# EAGLE design statuspanel (EAGLE 9.6.2)
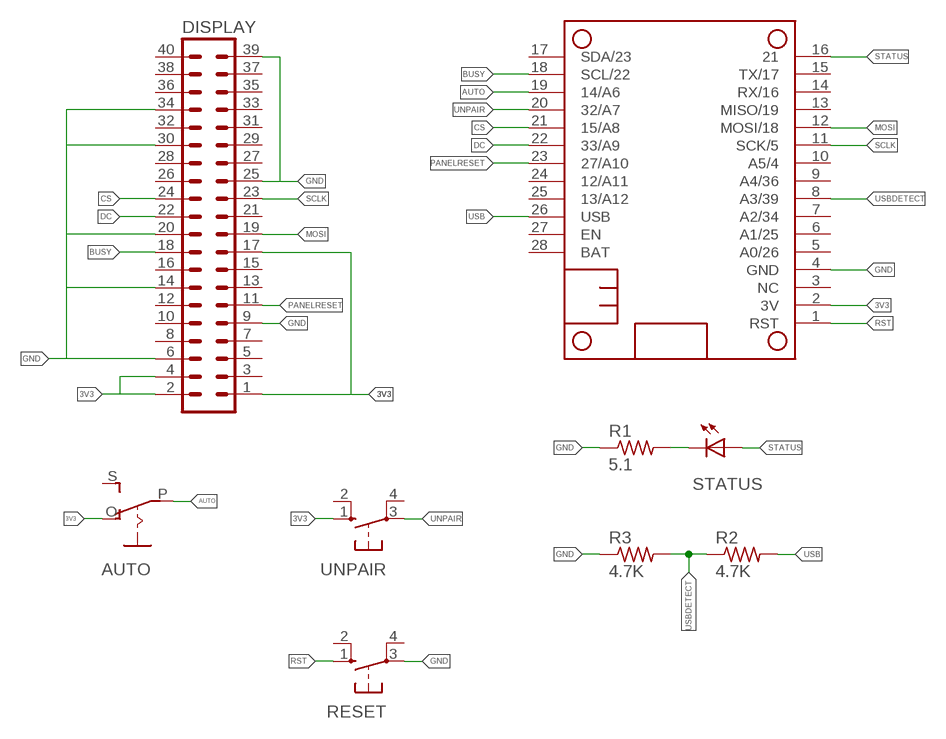
[diagram p0: schematic, sheet 1]

## Parts
AUTO  EG1218S  [EG1218]
DISPLAY  MA20-2  [MA20-2]
HUZZAH32  HUZZAH32_NODIM  [FEATHERWING_DIM]
R1  5.1  R-US_R0805  [R0805]
R2  4.7K  R-US_R0805  [R0805]
R3  4.7K  R-US_R0805  [R0805]
RESET  10-XX  [B3F-10XX]
STATUS  LED3MM  [LED3MM]
UNPAIR  10-XX  [B3F-10XX]

## Nets
3V3: AUTO.O DISPLAY.1 DISPLAY.2 DISPLAY.4 DISPLAY.17 HUZZAH32.2(3V) UNPAIR.1(S)
AUTO: AUTO.P HUZZAH32.19(14/A6)
BUSY: DISPLAY.18 HUZZAH32.18(SCL/22)
CS: DISPLAY.24 HUZZAH32.21(15/A8)
DC: DISPLAY.22 HUZZAH32.22(33/A9)
GND: DISPLAY.6 DISPLAY.9 DISPLAY.14 DISPLAY.20 DISPLAY.25 DISPLAY.30 DISPLAY.34 DISPLAY.39 HUZZAH32.4(GND) R1.1 R3.1 RESET.3(P)
MOSI: DISPLAY.19 HUZZAH32.12(MOSI/18)
N$3: R1.2 STATUS.K(C)
PANELRESET: DISPLAY.11 HUZZAH32.23(27/A10)
RST: HUZZAH32.1(RST) RESET.1(S)
SCLK: DISPLAY.23 HUZZAH32.11(SCK/5)
STATUS: HUZZAH32.16 STATUS.A
UNPAIR: HUZZAH32.20(32/A7) UNPAIR.3(P)
USB: HUZZAH32.26(USB) R2.2
USBDETECT: HUZZAH32.8(A3/39) R2.1 R3.2
Unconnected: AUTO.S DISPLAY.3 DISPLAY.5 DISPLAY.7 DISPLAY.8 DISPLAY.10 DISPLAY.12 DISPLAY.13 DISPLAY.15 DISPLAY.16 DISPLAY.21 DISPLAY.26 DISPLAY.27 DISPLAY.28 DISPLAY.29 DISPLAY.31 DISPLAY.32 DISPLAY.33 DISPLAY.35 DISPLAY.36 DISPLAY.37 DISPLAY.38 DISPLAY.40 HUZZAH32.3(NC) HUZZAH32.5(A0/26) HUZZAH32.6(A1/25) HUZZAH32.7(A2/34) HUZZAH32.9(A4/36) HUZZAH32.10(A5/4) HUZZAH32.13(MISO/19) HUZZAH32.14(RX/16) HUZZAH32.15(TX/17) HUZZAH32.17(SDA/23) HUZZAH32.24(12/A11) HUZZAH32.25(13/A12) HUZZAH32.27(EN) HUZZAH32.28(BAT) RESET.2(S1) RESET.4(P1) UNPAIR.2(S1) UNPAIR.4(P1)

## Library data of the parts
AUTO = adafruit:EG1218: SLIDING SWITCH 0.1" spacing through hole, vertical SPDT slide switch http://www.ladyada.net/library/pcb/eaglelibrary.html
DISPLAY = con-lstb:MA20-2: PIN HEADER; OC_FARNELL: unknown; OC_NEWARK: unknown
HUZZAH32 = tomscis_huzzah32:HUZZAH32
R1-R3 = adafruit:R-US_: RESISTOR, American symbol
RESET UNPAIR = switch-omron:10-XX: OMRON SWITCH; MPN: B3F-1000; OC_FARNELL: 176432; OC_NEWARK: 36M3542
STATUS = adafruit:LED: LED OSRAM: - CHIPLED LG R971, LG N971, LY N971, LG Q971, LY Q971, LO R971, LY R971 LH N974, LH R974 LS Q976, LO Q976, LY Q976 LO Q996 - Hyper CHIPLED LW Q18S LB Q993, LB Q99A, LB R99A - SideLED LS A670, LO A670, LY A670, LG A670, LP A670 LB A673, LV A673, LT A673, LW A673 LH A674 LY A675 LS A676, LA A676, LO A676, LY A676, LW A676 LS A679, LY A679, LG A679 - Hyper Micro SIDELED® LS Y876, LA Y876, LO Y876, LY Y876 LT Y87S - SmartLED LW L88C, LW L88S LB L89C, LB L89S, LG L890 LS L89K, LO L89K, LY L89K LS L896, LA L896, LO L896, LY L896 - TOPLED LS T670, LO T670, LY T670, LG T670, LP T670 LSG T670, LSP T670, LSY T670, LOP T670, LYG T670 LG T671, LOG T671, LSG T671 LB T673, LV T673, LT T673, LW T673 LH T674 LS T676, LA T676, LO T676, LY T676, LB T676, LH T676, LSB T676, LW T676 LB T67C, LV T67C, LT T67C, LS T67K, LO T67K, LY T67K, LW E67C LS E67B, LA E67B, LO E67B, LY E67B, LB E67C, LV E67C, LT E67C LW T67C LS T679, LY T679, LG T679 LS T770, LO T770, LY T770, LG T770, LP T770 LB T773, LV T773, LT T773, LW T773 LH T774 LS E675, LA E675, LY E675, LS T675 LS T776, LA T776, LO T776, LY T776, LB T776 LHGB T686 LT T68C, LB T68C - Hyper Mini TOPLED® LB M676 - Mini TOPLED Santana® LG M470 LS M47K, LO M47K, LY M47K Source: http://www.osram.convergy.de/

## Board
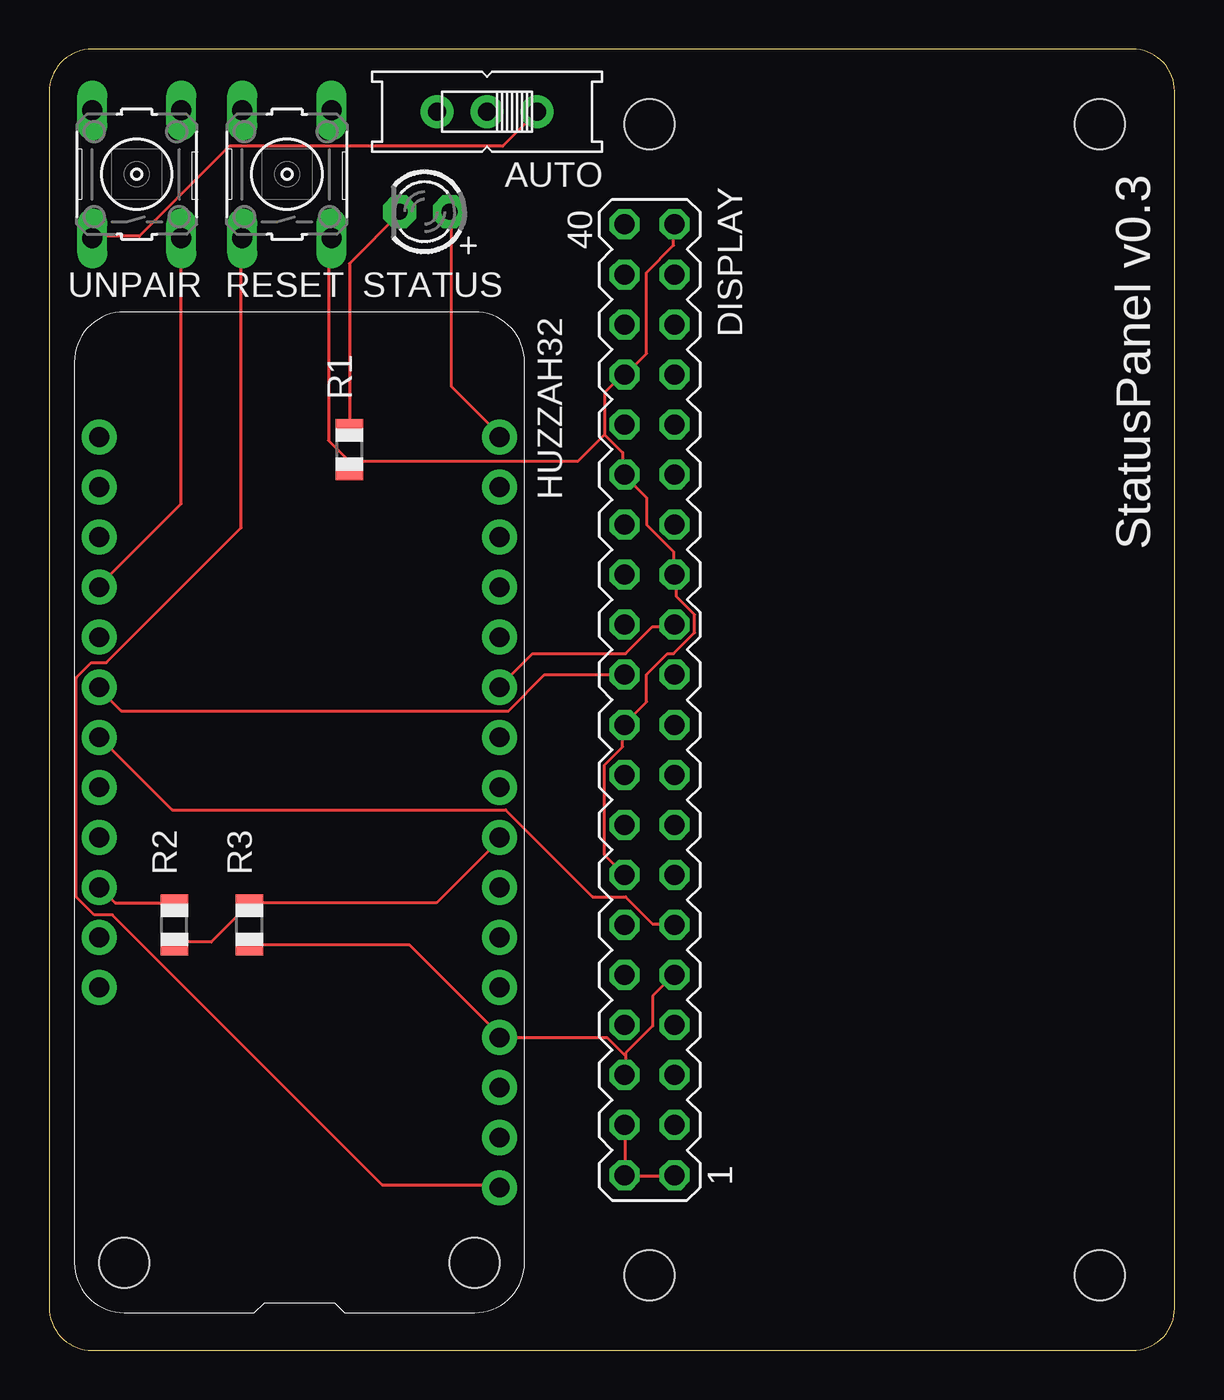
[diagram p1: board, top side]
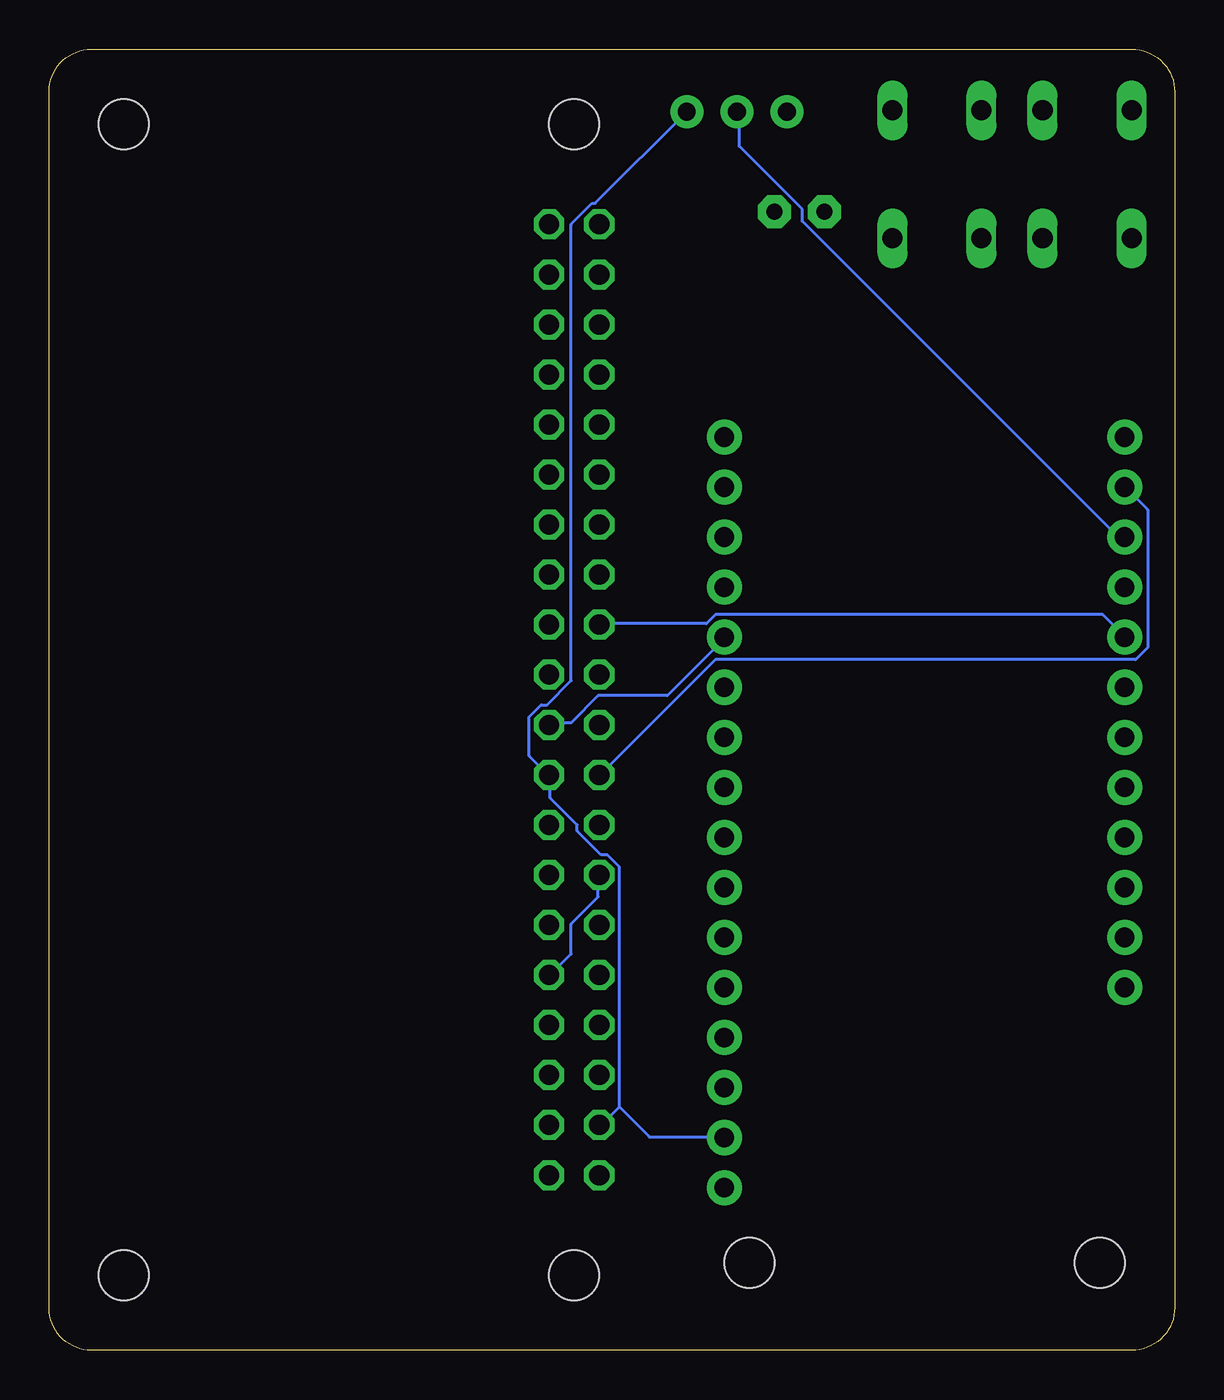
[diagram p2: board, bottom side, seen from below]

Size 57.13 x 66.04 mm. Coordinates in mm from the lower left corner, seen from the top.
Outline: 2.17,0 55,0 arc90 57.13,2.13 57.13,63.91 arc90 55,66.04 2.17,66.04 arc90 0,63.87 0,2.17 arc90 2.17,0
Copper layers (1*16): Top 0.035mm / dielectric 1.5mm / Bottom 0.035mm
Design rules "default": minimum track width 6mil, minimum drill 0.35mm, track to track 6mil, track to pad 6mil, pad to pad 6mil, via to via 6mil, smd to smd 6mil, copper to edge 40mil, drill to drill 6mil, minimum pad ring 10mil, minimum via ring 8mil, stop-mask expansion 4mil, vias tented up to drill 0mil, thermal gap 10mil
Holes 2.54 mm at 30.48,3.81 30.48,62.23 21.59,4.45 3.81,4.45 53.34,62.23 53.34,3.81

### Footprints (pad centres in the part's own frame; a part is rotated, then mirrored left to right if it is on the bottom)
EG1218 = drill 0.9 pad 1.676: O -2.54,0; P 0,0; S 2.54,0
MA20-2 = drill 1.016 octagon: 1 -24.13,-1.27; 2 -24.13,1.27; 3 -21.59,-1.27; 4 -21.59,1.27; 5 -19.05,-1.27; 6 -19.05,1.27; 7 -16.51,-1.27; 8 -16.51,1.27; 9 -13.97,-1.27; 10 -13.97,1.27; 11 -11.43,-1.27; 12 -11.43,1.27; 13 -8.89,-1.27; 14 -8.89,1.27; 15 -6.35,-1.27; 16 -6.35,1.27; 17 -3.81,-1.27; 18 -3.81,1.27; 19 -1.27,-1.27; 20 -1.27,1.27; 21 1.27,-1.27; 22 1.27,1.27; 23 3.81,-1.27; 24 3.81,1.27; 25 6.35,-1.27; 26 6.35,1.27; 27 8.89,-1.27; 28 8.89,1.27; 29 11.43,-1.27; 30 11.43,1.27; 31 13.97,-1.27; 32 13.97,1.27; 33 16.51,-1.27; 34 16.51,1.27; 35 19.05,-1.27; 36 19.05,1.27; 37 21.59,-1.27; 38 21.59,1.27; 39 24.13,-1.27; 40 24.13,1.27
FEATHERWING_DIM = drill 1 pad 1.778: 1 6.35,1.27; 2 8.89,1.27; 3 11.43,1.27; 4 13.97,1.27; 5 16.51,1.27; 6 19.05,1.27; 7 21.59,1.27; 8 24.13,1.27; 9 26.67,1.27; 10 29.21,1.27; 11 31.75,1.27; 12 34.29,1.27; 13 36.83,1.27; 14 39.37,1.27; 15 41.91,1.27; 16 44.45,1.27; 17 44.45,21.59; 18 41.91,21.59; 19 39.37,21.59; 20 36.83,21.59; 21 34.29,21.59; 22 31.75,21.59; 23 29.21,21.59; 24 26.67,21.59; 25 24.13,21.59; 26 21.59,21.59; 27 19.05,21.59; 28 16.51,21.59
R0805 = smd 1.1 x 1.4: 1 -1,0; 2 1,0
B3F-10XX = drill 1.016 long: 1 -3.251,2.261; 2 3.251,2.261; 3 -3.251,-2.261; 4 3.251,-2.261
LED3MM = drill 0.813 pad 1.676 octagon: A -1.27,0; K 1.27,0

### Placement (x,y rotation side)
AUTO  22.23,62.87 180 top
DISPLAY  30.48,33.02 90 top
HUZZAH32  24.13,1.91 90 top
R1  330  [R0805]  15.24,45.72 90 top
R2  6.35,21.59 90 top
R3  10.16,21.59 90 top
RESET  12.06,59.69 90 top
STATUS  19.05,57.78 180 top
UNPAIR  4.45,59.69 90 top

### Tracks (layer width: path | path; a pad name or v marks a point on that pad's centre or on a via)
3V3
  Top 0.152: AUTO.O 23.01,61.11 9.14,61.11 4.57,56.54 2.29,56.54 UNPAIR.1 | DISPLAY.1 31.7,8.84 29.26,8.84 DISPLAY.2 29.26,8.99 29.26,11.43 DISPLAY.4
  Bottom 0.152: 28.19,12.34 28.19,24.54 28.8,25.15 29.11,25.15 30.33,26.36 30.33,26.67 31.7,28.04 31.7,29.11 DISPLAY.17 31.85,29.26 32.77,30.18 32.77,32.16 32.16,32.77 31.85,32.77 30.63,33.98 30.63,57.15 29.57,58.22 29.41,58.22 AUTO.O | 28.19,12.34 29.11,11.43 DISPLAY.4 | 28.19,12.34 26.67,10.82 22.86,10.82 HUZZAH32.2
AUTO
  Bottom 0.152: AUTO.P 22.1,62.79 22.1,61.11 18.9,57.91 18.9,57.3 2.9,41.3 2.59,41.3 HUZZAH32.19
BUSY
  Bottom 0.152: DISPLAY.18 29.11,29.26 23.32,35.05 1.98,35.05 1.37,35.66 1.37,42.67 2.44,43.74 HUZZAH32.18
CS
  Bottom 0.152: DISPLAY.24 29.11,36.88 23.77,36.88 23.32,37.34 3.66,37.34 2.59,36.27 HUZZAH32.21
DC
  Top 0.152: DISPLAY.22 25.15,34.29 23.32,32.46 3.66,32.46 2.59,33.53 HUZZAH32.22
GND
  Top 0.152: 15.24,45.11 R1.1 15.24,44.81 | 15.24,45.11 14.17,46.18 14.17,56.24 14.33,56.39 RESET.3 | 28.19,46.48 29.11,45.57 29.11,44.5 DISPLAY.30 29.26,44.35 30.33,43.28 30.33,41.91 31.7,40.54 31.7,39.47 DISPLAY.25 31.85,39.32 31.85,38.25 32.77,37.34 32.77,36.42 31.7,35.36 31.39,35.36 30.33,34.29 30.33,32.92 29.26,31.85 DISPLAY.20 29.11,31.7 29.11,30.63 28.19,29.72 28.19,25.15 DISPLAY.14 | 28.19,46.48 28.19,48.62 29.11,49.53 DISPLAY.34 29.26,49.53 30.33,50.6 30.33,54.71 31.7,56.08 31.7,57.15 DISPLAY.39 | 15.24,45.11 26.82,45.11 28.19,46.48 | R3.1 10.21,20.57 18.29,20.57 22.86,16 HUZZAH32.4 22.86,15.85 28.35,15.85 29.26,14.94 | 29.26,14.94 29.26,15.09 30.63,16.46 30.63,17.98 31.7,19.05 DISPLAY.9 | 29.26,14.94 29.26,14.02 DISPLAY.6
  Bottom 0.152: DISPLAY.14 29.26,24.08 29.26,23.01 30.63,21.64 30.63,20.12 31.7,19.05 DISPLAY.9
MOSI
  Bottom 0.152: DISPLAY.19 31.7,31.85 30.63,31.85 29.26,33.22 25.76,33.22 22.86,36.12 HUZZAH32.12
N$3
  Top 0.152: R1.2 15.24,55.17 17.83,57.76 STATUS.K
PANELRESET
  Top 0.152: DISPLAY.11 31.7,21.64 30.63,21.64 29.26,23.01 27.58,23.01 23.16,27.43 6.25,27.43 2.59,31.09 HUZZAH32.23
RST
  Top 0.152: RESET.1 9.75,56.39 9.75,41.76 2.9,34.9 2.13,34.9 1.37,34.14 1.37,23.01 2.29,22.1 3.2,22.1 16.92,8.38 22.86,8.38 HUZZAH32.1
SCLK
  Top 0.152: DISPLAY.23 31.7,36.73 30.63,36.73 29.26,35.36 24.54,35.36 22.86,33.68 HUZZAH32.11
STATUS
  Top 0.152: STATUS.A 20.42,57.76 20.42,48.92 22.86,46.48 HUZZAH32.16
UNPAIR
  Top 0.152: UNPAIR.3 6.71,42.98 2.59,38.86 HUZZAH32.20
USB
  Top 0.152: R2.2 6.25,22.71 3.35,22.71 2.59,23.47 HUZZAH32.26
USBDETECT
  Top 0.152: R2.1 6.4,20.73 8.23,20.73 10.06,22.55 R3.2 10.21,22.71 19.66,22.71 22.86,25.91 HUZZAH32.8

### Text on the board
tNames: HUZZAH32 | StatusPanel v0.3